# EAGLE design spoke-biere (EAGLE 5.11)
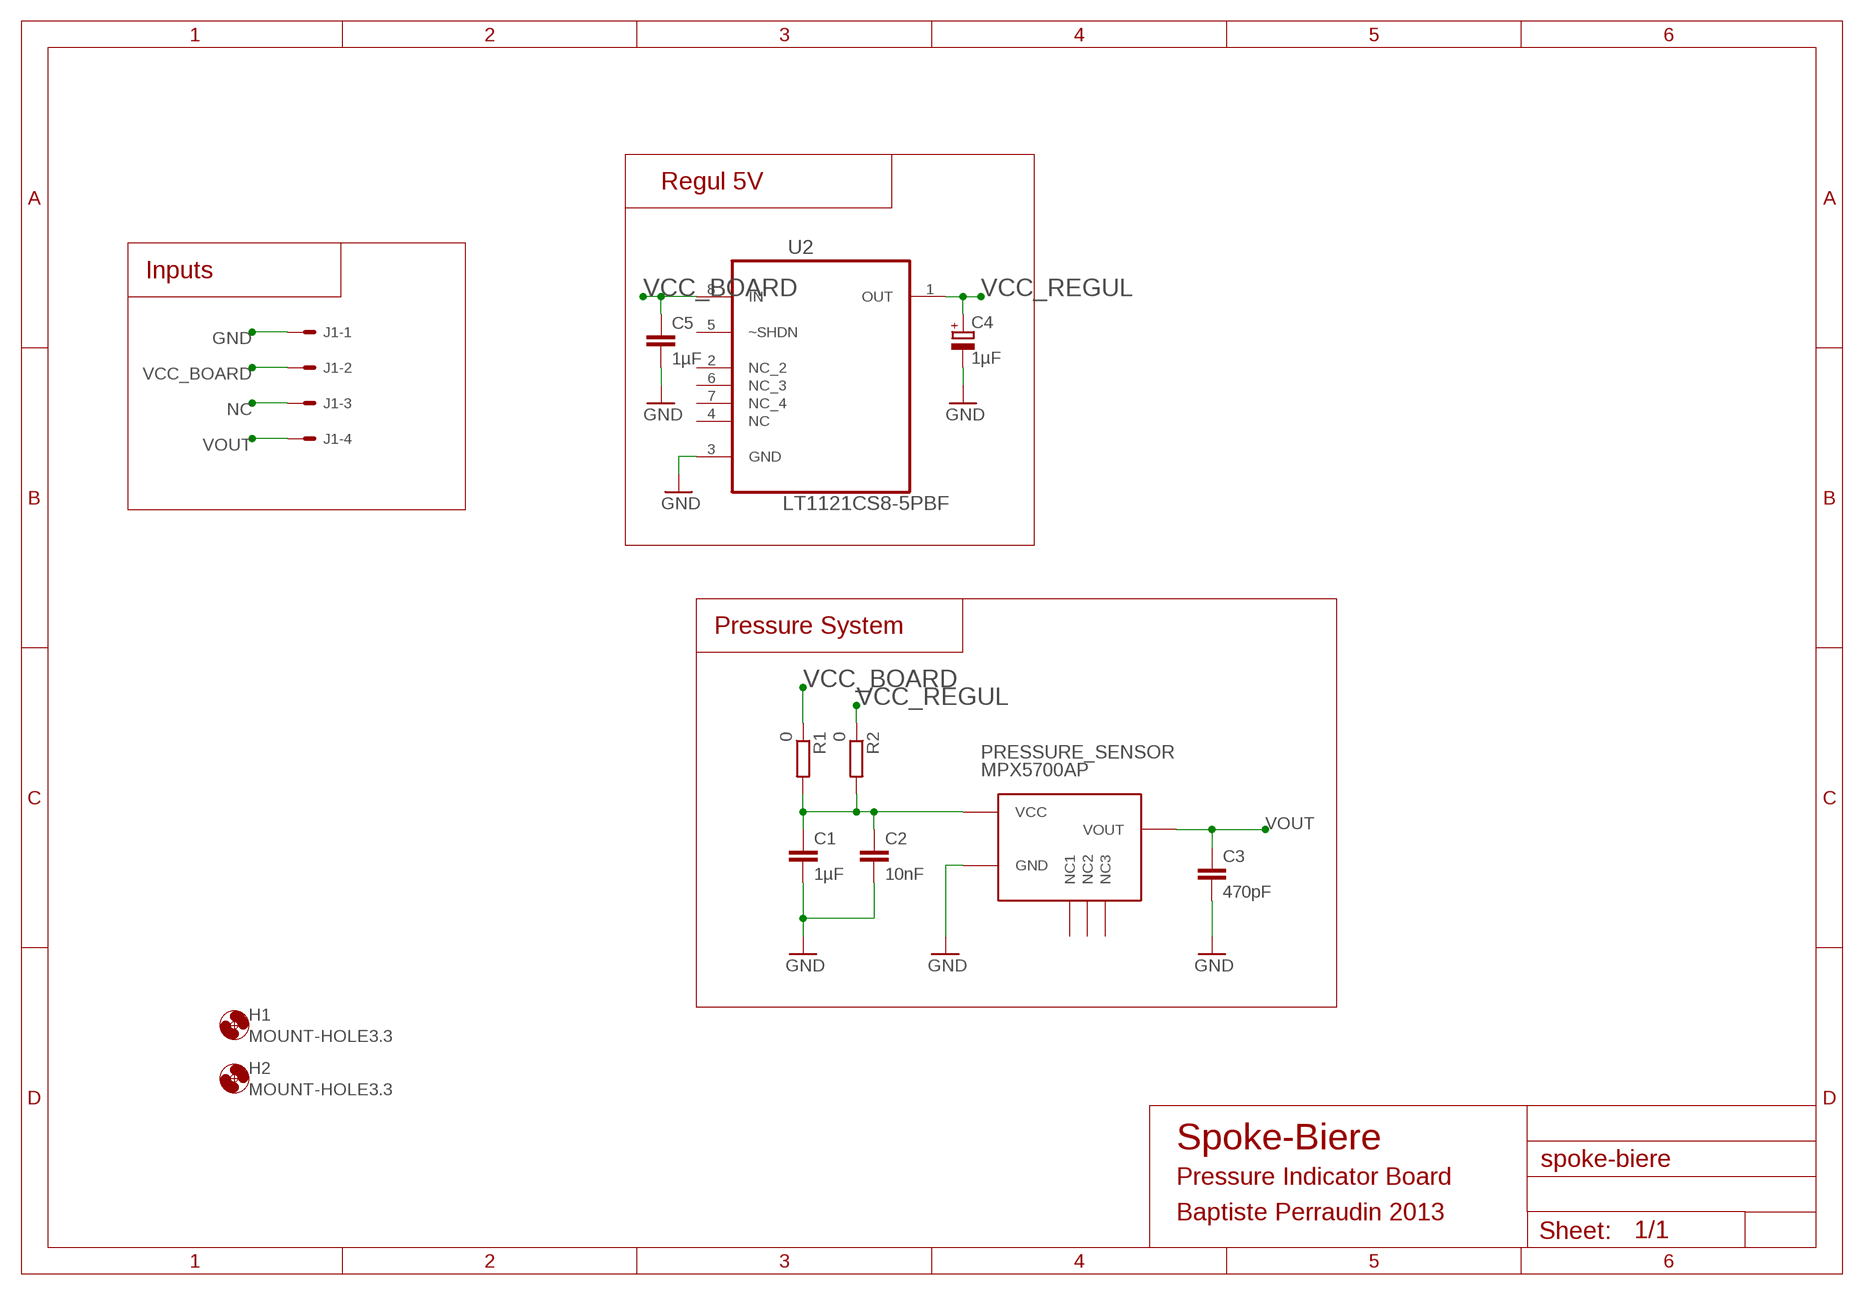
[diagram p0: schematic, sheet 1]

## Parts
C1  1µF  C-EUC0603  [C0603]
C2  10nF  C-EUC0603  [C0603]
C3  470pF  C-EUC0603  [C0603]
C4  1µF  CPOL-EUA  [PANASONIC_A]
C5  1µF  C-EUC0603  [C0603]
H1  MOUNT-HOLE3.3  [3,3]
H2  MOUNT-HOLE3.3  [3,3]
J1  ED1X04  [ED1X04]
PRESSURE_SENSOR  MPX5700AP  [MPX5700AP]
R1  0  R-EU_R0805  [R0805]
R2  0  R-EU_R0805  [R0805]
U2  LT1121CS8-5PBF  [SOIC127P600X175-8N]

## Nets
GND [supply]: C1.2 C2.2 C3.2 C4.- C5.2 J1.1 PRESSURE_SENSOR.P$2(GND) U2.3(GND)
N$1: C1.1 C2.1 PRESSURE_SENSOR.P$3(VCC) R1.2 R2.2
NC: J1.3
VCC_BOARD: C5.1 J1.2 R1.1 U2.8(IN)
VCC_REGUL: C4.+ R2.1 U2.1(OUT)
VOUT: C3.1 J1.4 PRESSURE_SENSOR.P$1(VOUT)
Unconnected: PRESSURE_SENSOR.P$4(NC1) PRESSURE_SENSOR.P$5(NC2) PRESSURE_SENSOR.P$6(NC3) U2.2(NC_2) U2.4(NC) U2.5(~SHDN) U2.6(NC_3) U2.7(NC_4)

## Notes on the sheet
- Regul 5V
- Inputs
- Pressure System
- Spoke-Biere
- Pressure Indicator Board
- Baptiste Perraudin 2013

## Library data of the parts
C1-C3 C5 = rcl:C-EU: CAPACITOR, European symbol
C4 = rcl:CPOL-EU: POLARIZED CAPACITOR, European symbol
H1 H2 = holes:MOUNT-HOLE: MOUNTING HOLE with drill center marker
J1 = apbteam_con-amp-he14:E?1X04: Male header simple row, 4 positions
PRESSURE_SENSOR = apbTeam:MPX5700AP
R1 R2 = rcl:R-EU_: RESISTOR, European symbol
U2 = LT1121CS8-5:LT1121CS8-5PBF: Micropower Low Dropout Regulators with Shutdown; MPN: LT1121CS8-5#PBF; OC_FARNELL: 9560076; OC_NEWARK: 57M1925; PACKAGE: SOIC-8; SUPPLIER: Linear Technology

## Net classes
1 supply: width 0.254 mm

## Board
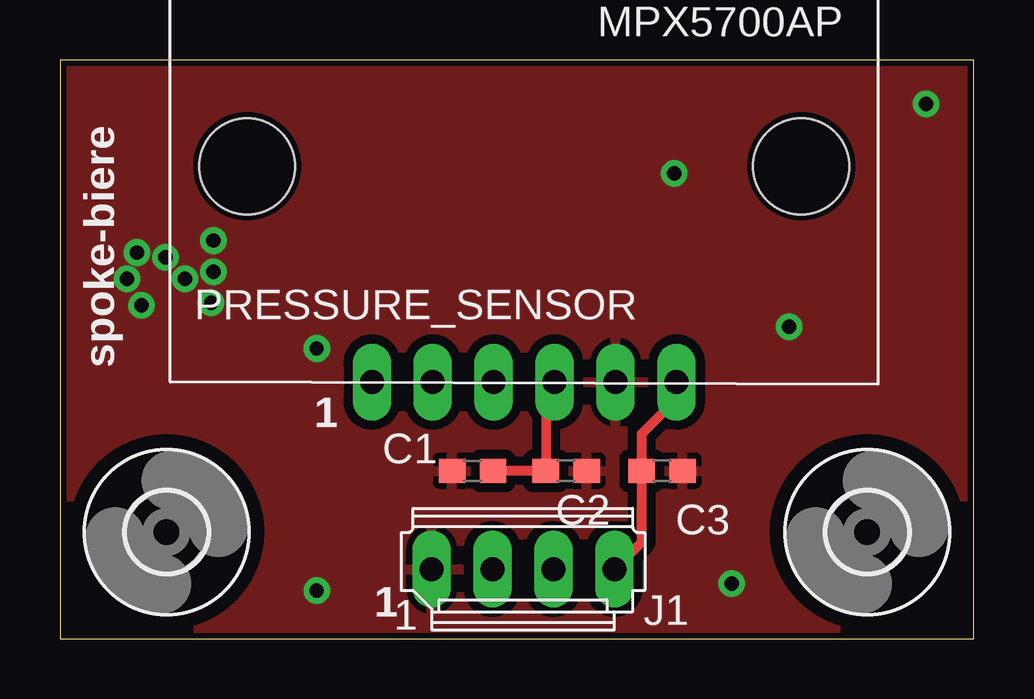
[diagram p1: board, top side]
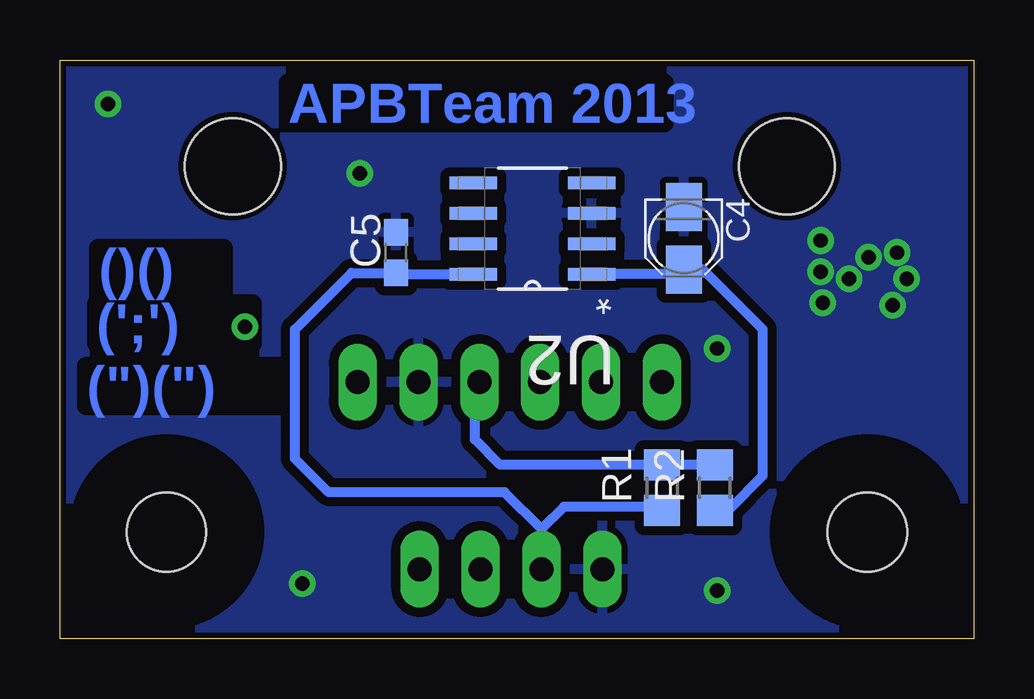
[diagram p2: board, bottom side, seen from below]

Size 38.1 x 24.13 mm. Coordinates in mm from the lower left corner, seen from the top.
Outline: 0,0 38.1,0 38.1,24.13 0,24.13 0,0
Copper layers (1*16): Top 0.035mm / dielectric 1.5mm / Bottom 0.035mm
Design rules "BatchPcb (Production) *": minimum track width 8mil, minimum drill 20mil, track to track 15mil, track to pad 15mil, pad to pad 15mil, via to via 15mil, smd to smd 5mil, copper to edge 10mil, drill to drill 8mil, minimum pad ring 12mil, minimum via ring 10mil, stop-mask expansion 4mil, vias tented up to drill 25mil, thermal gap 10mil

### Footprints (pad centres in the part's own frame; a part is rotated, then mirrored left to right if it is on the bottom)
C0603 = smd 1.1 x 1: 1 -0.85,0; 2 0.85,0
PANASONIC_A = smd 2 x 1.5: + 1.3,0; - -1.3,0
3,3 = hole 3.3: 0,0
ED1X04 = drill 1 long: 1 -3.81,0; 2 -1.27,0; 3 1.27,0; 4 3.81,0
MPX5700AP = drill 1 long: P$1 12.7,0; P$2 10.16,0; P$3 7.62,0; P$4 5.08,0; P$5 2.54,0; P$6 0,0 | hole 4: -5.2,9; 17.9,9
R0805 = smd 1.3 x 1.5: 1 -0.95,0; 2 0.95,0
SOIC127P600X175-8N = smd 1.981 x 0.533: 1 -2.464,1.905; 2 -2.464,0.635; 3 -2.464,-0.635; 4 -2.464,-1.905; 5 2.464,-1.905; 6 2.464,-0.635; 7 2.464,0.635; 8 2.464,1.905

### Placement (x,y rotation side)
C1  17.2,7 180 top
C2  21.1,7 0 top
C3  25.1,7 0 top
C4  12.1,16.7 270 bottom
C5  24.1,16.1 90 bottom
H1  4.45,4.45 0 top
H2  33.66,4.45 0 top
J1  19.3,2.9 0 top
PRESSURE_SENSOR  13,10.7 0 top
R1  13,6.3 90 bottom
R2  10.8,6.3 90 bottom
U2  18.4,17.1 180 bottom

### Tracks (layer width: path | path; a pad name or v marks a point on that pad's centre or on a via)
GND  (via drill 0.6)
  other vias: 25.6,19.4 10.7,12.1 36.1,22.3 6.3,14 6.4,16.6 3.4,13.9 2.8,15 4.4,15.9 10.7,2 5.2,15 3.2,16.1 6.4,15.3 30.4,13 28,2.3
  pour Top: 0.1,24 38,24 38,-0.1 0,-0.1 0,24.1
  pour Bottom: 0,24.1 38.1,24.1 38.1,-0.1 0,-0.1
N$1
  Top 0.406: C1.1 C2.1 20.25,10.33 PRESSURE_SENSOR.P$3
  Bottom 0.406: PRESSURE_SENSOR.P$3 20.8,10.52 20.8,8.3 19.75,7.25 R1.2 R2.2
VCC_BOARD
  Bottom 0.406: 18.03,4.57 J1.2 | 18.03,4.57 17.1,5.5 13.15,5.5 R1.1 | 18.03,4.57 19.56,6.1 26.9,6.1 28.3,7.5 28.3,12.9 25.95,15.25 C5.1 24.05,15.2 U2.8
VCC_REGUL
  Bottom 0.406: R2.1 10.75,5.4 10.2,5.4 8.8,6.8 8.8,12.9 11.3,15.4 C4.+ 12.3,15.2 U2.1
VOUT
  Top 0.406: J1.4 24.25,4.04 C3.1 24.25,8.55 25.7,10 PRESSURE_SENSOR.P$1

### Text on the board
Bottom: APBTeam 2013 | ()() | (';') | (")(")
tSilk: spoke-biere | 1 | 1